# EAGLE design hp3547DisplayV2 (EAGLE 6.6.0)
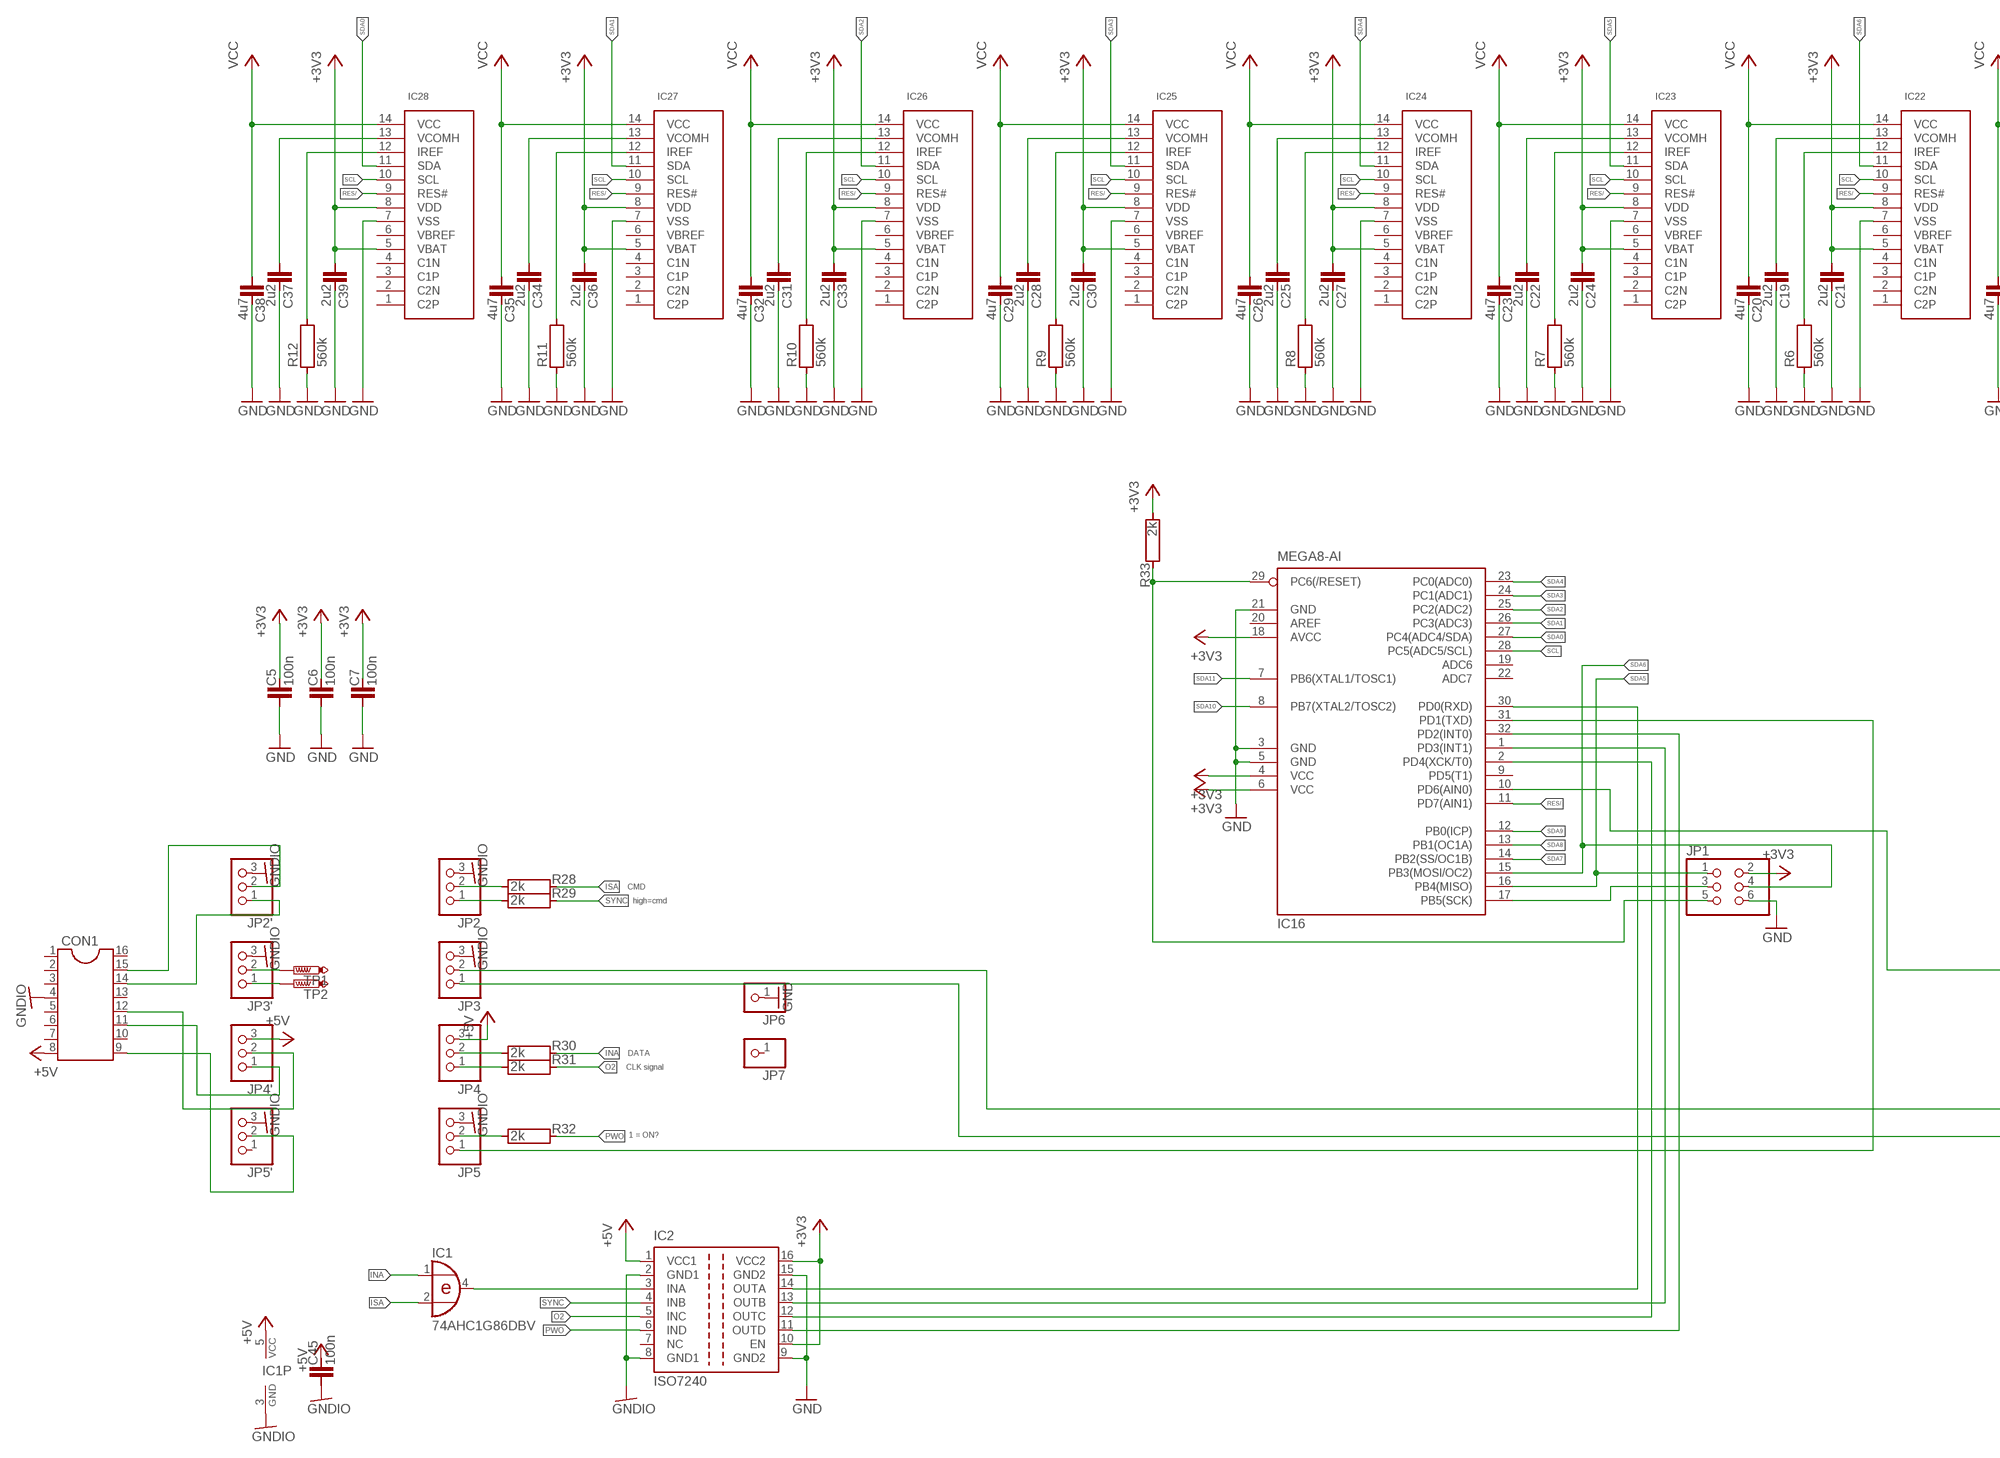
[diagram p0: schematic, sheet 1, part 1 of 2]
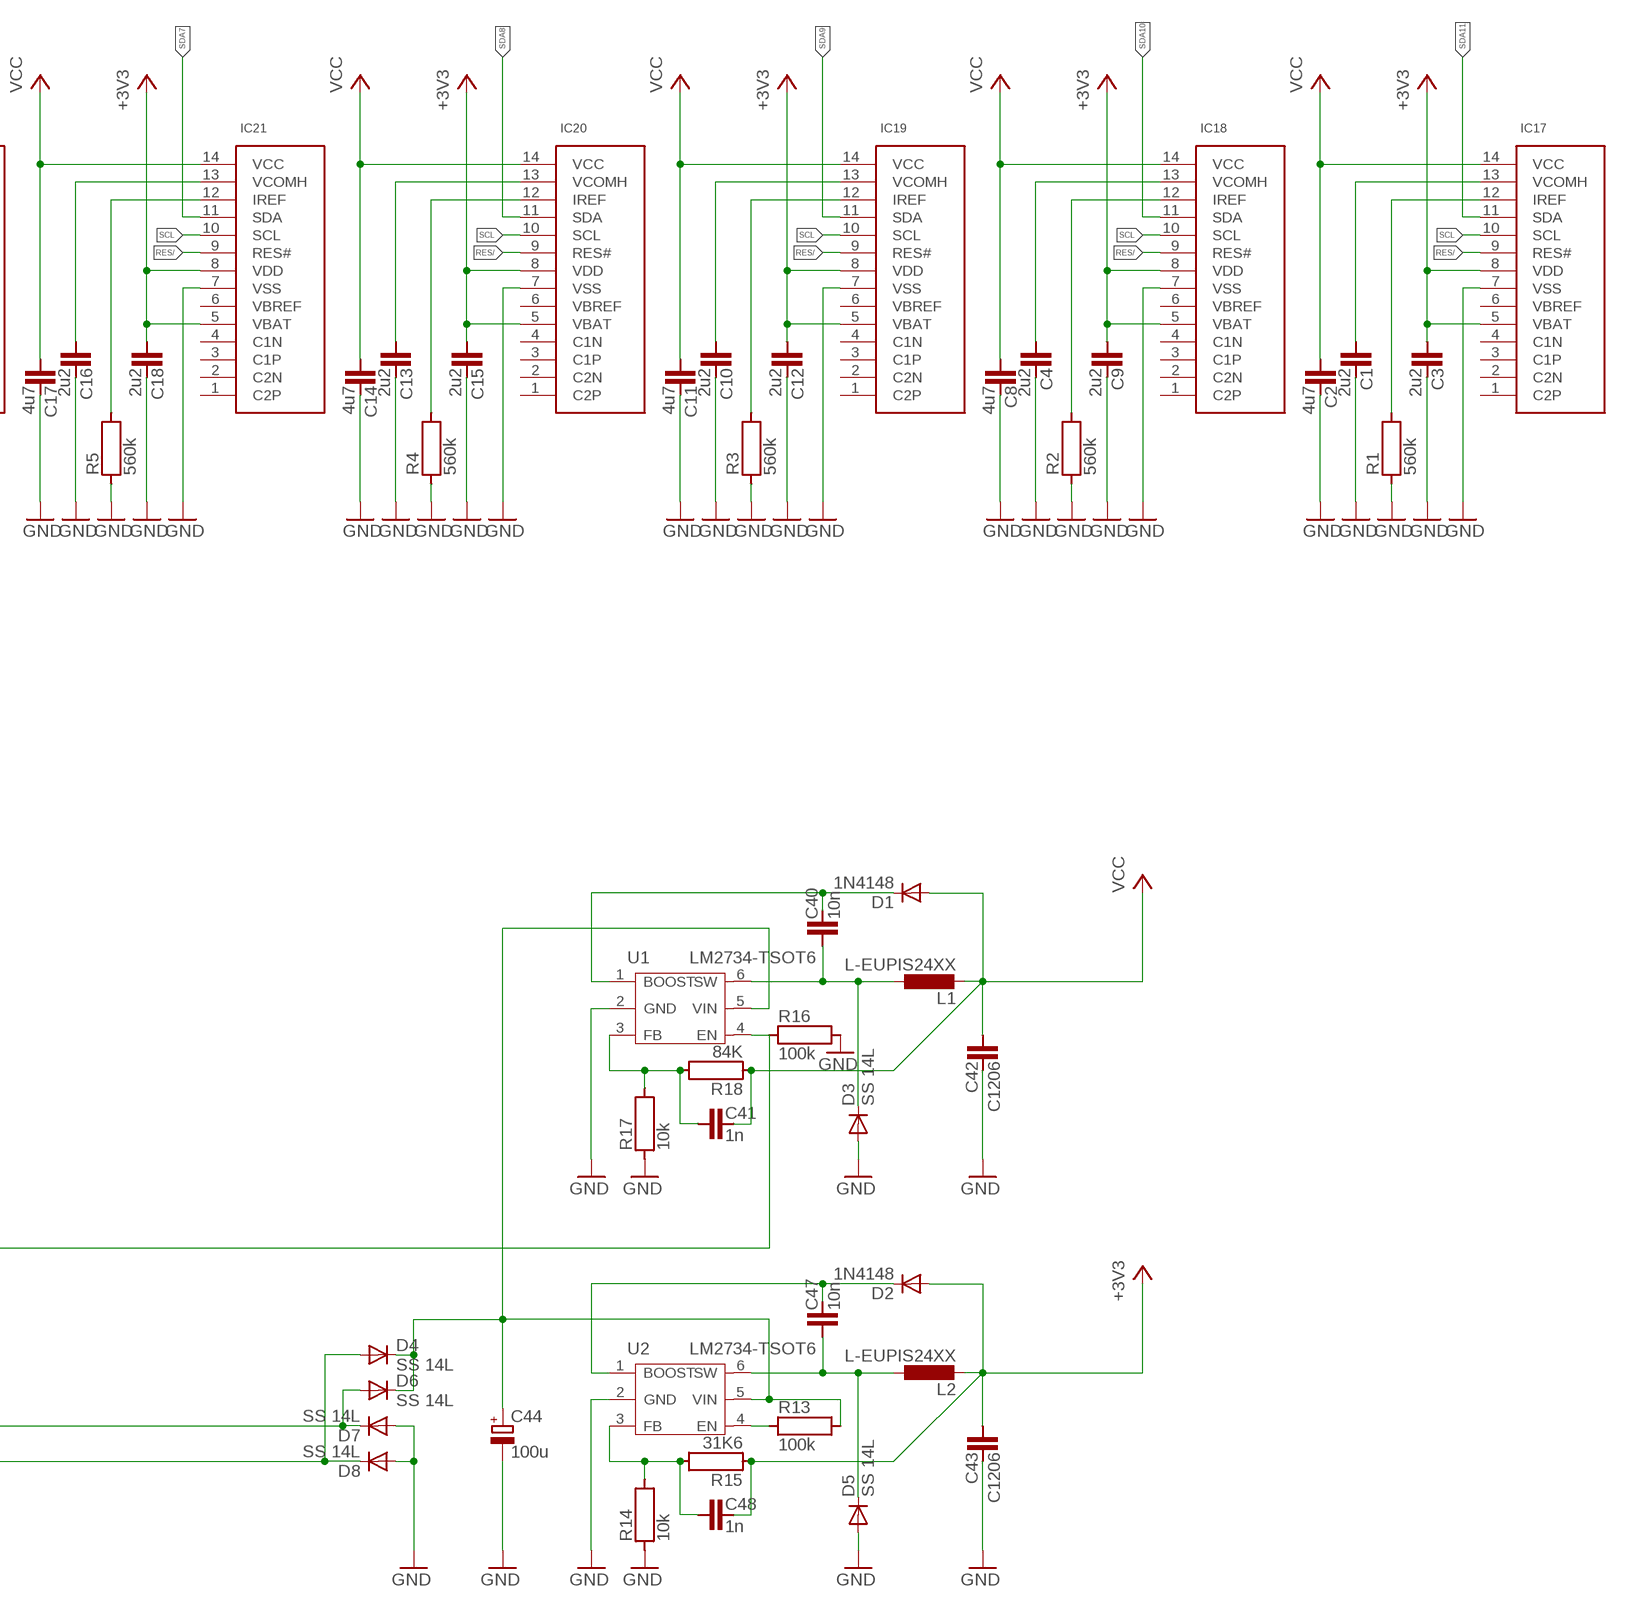
[diagram p1: schematic, sheet 1, part 2 of 2]

## Parts
C1  2u2  C0603  [C0603]
C2  4u7  C0805  [C0805]
C3  2u2  C0603  [C0603]
C4  2u2  C0603  [C0603]
C5  100n  C0603  [C0603]
C6  100n  C0603  [C0603]
C7  100n  C0603  [C0603]
C8  4u7  C0805  [C0805]
C9  2u2  C0603  [C0603]
C10  2u2  C0603  [C0603]
C11  4u7  C0805  [C0805]
C12  2u2  C0603  [C0603]
C13  2u2  C0603  [C0603]
C14  4u7  C0805  [C0805]
C15  2u2  C0603  [C0603]
C16  2u2  C0603  [C0603]
C17  4u7  C0805  [C0805]
C18  2u2  C0603  [C0603]
C19  2u2  C0603  [C0603]
C20  4u7  C0805  [C0805]
C21  2u2  C0603  [C0603]
C22  2u2  C0603  [C0603]
C23  4u7  C0805  [C0805]
C24  2u2  C0603  [C0603]
C25  2u2  C0603  [C0603]
C26  4u7  C0805  [C0805]
C27  2u2  C0603  [C0603]
C28  2u2  C0603  [C0603]
C29  4u7  C0805  [C0805]
C30  2u2  C0603  [C0603]
C31  2u2  C0603  [C0603]
C32  4u7  C0805  [C0805]
C33  2u2  C0603  [C0603]
C34  2u2  C0603  [C0603]
C35  4u7  C0805  [C0805]
C36  2u2  C0603  [C0603]
C37  2u2  C0603  [C0603]
C38  4u7  C0805  [C0805]
C39  2u2  C0603  [C0603]
C40  10n  C0603  [C0603]
C41  1n  C0603  [C0603]
C42  C1206  [C1206]
C43  C1206  [C1206]
C44  100u  CPOL-EUE  [PANASONIC_E]
C45  100n  C0603  [C0603]
C47  10n  C0603  [C0603]
C48  1n  C0603  [C0603]
CON1  DIL16BIGHOLE  [DIL16BIGHOLE]
D1  1N4148  DIODE-DO214AC  [DO214AC]
D2  1N4148  DIODE-DO214AC  [DO214AC]
D3  SS 14L  CGRM4001-G  [SOD-123_MINI-SMA]
D4  SS 14L  CGRM4001-G  [SOD-123_MINI-SMA]
D5  SS 14L  CGRM4001-G  [SOD-123_MINI-SMA]
D6  SS 14L  CGRM4001-G  [SOD-123_MINI-SMA]
D7  SS 14L  CGRM4001-G  [SOD-123_MINI-SMA]
D8  SS 14L  CGRM4001-G  [SOD-123_MINI-SMA]
IC1  74AHC1G86DBV  [SOT23-5]
IC2  ISO7240  [SO-16DW]
IC16  MEGA8-AI  [TQFP32-08]
IC17  OLED0.87  [OLED0.87]
IC18  OLED0.87  [OLED0.87]
IC19  OLED0.87  [OLED0.87]
IC20  OLED0.87  [OLED0.87]
IC21  OLED0.87  [OLED0.87]
IC22  OLED0.87  [OLED0.87]
IC23  OLED0.87  [OLED0.87]
IC24  OLED0.87  [OLED0.87]
IC25  OLED0.87  [OLED0.87]
IC26  OLED0.87  [OLED0.87]
IC27  OLED0.87  [OLED0.87]
IC28  OLED0.87  [OLED0.87]
JP1  PINHD-2X3  [2X03]
JP2  PINHD-1X3  [1X03]
JP2'  PINHD-1X3  [1X03]
JP3  PINHD-1X3  [1X03]
JP3'  PINHD-1X3  [1X03]
JP4  PINHD-1X3  [1X03]
JP4'  PINHD-1X3  [1X03]
JP5  PINHD-1X3  [1X03]
JP5'  PINHD-1X3  [1X03]
JP6  PINHD-1X1  [1X01]
JP7  PINHD-1X1  [1X01]
L1  L-EUPIS24XX  [PIS24XX]
L2  L-EUPIS24XX  [PIS24XX]
R1  560k  R0402  [R0402]
R2  560k  R0402  [R0402]
R3  560k  R0402  [R0402]
R4  560k  R0402  [R0402]
R5  560k  R0402  [R0402]
R6  560k  R0402  [R0402]
R7  560k  R0402  [R0402]
R8  560k  R0402  [R0402]
R9  560k  R0402  [R0402]
R10  560k  R0402  [R0402]
R11  560k  R0402  [R0402]
R12  560k  R0402  [R0402]
R13  100k  R0603  [R0603]
R14  10k  R0603  [R0603]
R15  31K6  R0603  [R0603]
R16  100k  R0603  [R0603]
R17  10k  R0603  [R0603]
R18  84K  R0603  [R0603]
R28  2k  R0603  [R0603]
R29  2k  R0603  [R0603]
R30  2k  R0603  [R0603]
R31  2k  R0603  [R0603]
R32  2k  R0603  [R0603]
R33  2k  R0603  [R0603]
TP1  PTR1PAD1-13Y  [P1-13Y]
TP2  PTR1PAD1-13Y  [P1-13Y]
U1  LM2734-TSOT6  [TSOT6]
U2  LM2734-TSOT6  [TSOT6]

## Nets
+3V3: C3.1 C5.2 C6.2 C7.2 C9.1 C12.1 C15.1 C18.1 C21.1 C24.1 C27.1 C30.1 C33.1 C36.1 C39.1 C43.1 C48.2 D2.A IC2.10(EN) IC2.16(VCC2) IC16.4(VCC) IC16.6(VCC) IC16.18(AVCC) IC17.5(VBAT) IC17.8(VDD) IC18.5(VBAT) IC18.8(VDD) IC19.5(VBAT) IC19.8(VDD) IC20.5(VBAT) IC20.8(VDD) IC21.5(VBAT) IC21.8(VDD) IC22.5(VBAT) IC22.8(VDD) IC23.5(VBAT) IC23.8(VDD) IC24.5(VBAT) IC24.8(VDD) IC25.5(VBAT) IC25.8(VDD) IC26.5(VBAT) IC26.8(VDD) IC27.5(VBAT) IC27.8(VDD) IC28.5(VBAT) IC28.8(VDD) JP1.2 L2.1 R15.1 R33.2
+5V: C45.2 CON1.8 IC1.5(VCC) IC2.1(VCC1) JP4'.3 JP4.3
GND: C1.2 C2.2 C3.2 C4.2 C5.1 C6.1 C7.1 C8.2 C9.2 C10.2 C11.2 C12.2 C13.2 C14.2 C15.2 C16.2 C17.2 C18.2 C19.2 C20.2 C21.2 C22.2 C23.2 C24.2 C25.2 C26.2 C27.2 C28.2 C29.2 C30.2 C31.2 C32.2 C33.2 C34.2 C35.2 C36.2 C37.2 C38.2 C39.2 C42.2 C43.2 C44.- D3.A D5.A D7.A D8.A IC2.9(GND2) IC2.15(GND2) IC16.3(GND) IC16.5(GND) IC16.21(GND) IC17.7(VSS) IC18.7(VSS) IC19.7(VSS) IC20.7(VSS) IC21.7(VSS) IC22.7(VSS) IC23.7(VSS) IC24.7(VSS) IC25.7(VSS) IC26.7(VSS) IC27.7(VSS) IC28.7(VSS) JP1.6 JP6.1 R1.1 R2.1 R3.1 R4.1 R5.1 R6.1 R7.1 R8.1 R9.1 R10.1 R11.1 R12.1 R14.1 R16.2 R17.1 U1.2(GND) U2.2(GND)
GNDIO: C45.1 CON1.4 IC1.3(GND) IC2.2(GND1) IC2.8(GND1) JP2'.3 JP2.3 JP3'.3 JP3.3 JP5'.3 JP5.3
INA: IC1.1(I0) R30.1
ISA: IC1.2(I1) R28.1
N$1: IC18.12(IREF) R2.2
N$2: C4.1 IC18.13(VCOMH)
N$3: IC17.12(IREF) R1.2
N$4: C1.1 IC17.13(VCOMH)
N$5: JP2.2 R28.2
N$6: IC19.12(IREF) R3.2
N$7: JP2.1 R29.2
N$8: C10.1 IC19.13(VCOMH)
N$9: JP4.2 R30.2
N$10: IC20.12(IREF) R4.2
N$11: C13.1 IC20.13(VCOMH)
N$12: JP4.1 R31.2
N$13: IC21.12(IREF) R5.2
N$14: C16.1 IC21.13(VCOMH)
N$15: JP5.2 R32.2
N$16: IC22.12(IREF) R6.2
N$17: C19.1 IC22.13(VCOMH)
N$18: C40.2 D1.C U1.1(BOOST)
N$19: IC23.12(IREF) R7.2
N$20: C22.1 IC23.13(VCOMH)
N$21: C40.1 D3.C L1.2 U1.6(SW)
N$22: IC24.12(IREF) R8.2
N$23: C25.1 IC24.13(VCOMH)
N$24: C47.2 D2.C U2.1(BOOST)
N$25: IC25.12(IREF) R9.2
N$26: C28.1 IC25.13(VCOMH)
N$27: C47.1 D5.C L2.2 U2.6(SW)
N$28: IC26.12(IREF) R10.2
N$29: C31.1 IC26.13(VCOMH)
N$30: C48.1 R14.2 R15.2 U2.3(FB)
N$31: IC27.12(IREF) R11.2
N$32: C34.1 IC27.13(VCOMH)
N$33: R13.1 U2.4(EN)
N$34: IC28.12(IREF) R12.2
N$35: C37.1 IC28.13(VCOMH)
N$36: IC16.31(PD1(TXD)) JP5.1
N$37: C41.1 R17.2 R18.2 U1.3(FB)
N$38: IC16.10(PD6(AIN0)) R16.1 U1.4(EN)
N$39: JP3'.1 TP2.TP
N$40: JP3'.2 TP1.TP
N$41: D6.A D7.C JP3.2
N$42: D4.A D8.C JP3.1
N$43: IC2.14(OUTA) IC16.30(PD0(RXD))
N$44: IC1.4(O) IC2.3(INA)
N$45: IC2.12(OUTC) IC16.2(PD4(XCK/T0))
N$46: IC2.13(OUTB) IC16.1(PD3(INT1))
N$47: IC2.11(OUTD) IC16.32(PD2(INT0))
N$48: IC16.29(PC6(/RESET)) JP1.5 R33.1
N$49: CON1.9 JP5'.2
N$51: IC16.17(PB5(SCK)) JP1.3
N$53: CON1.11 JP4'.1
N$54: CON1.12 JP4'.2
N$55: CON1.14 JP2'.1
N$56: CON1.15 JP2'.2
O2: IC2.5(INC) R31.1
PWO: IC2.6(IND) R32.1
RES/: IC16.11(PD7(AIN1)) IC17.9(RES#) IC18.9(RES#) IC19.9(RES#) IC20.9(RES#) IC21.9(RES#) IC22.9(RES#) IC23.9(RES#) IC24.9(RES#) IC25.9(RES#) IC26.9(RES#) IC27.9(RES#) IC28.9(RES#)
SCL: IC16.28(PC5(ADC5/SCL)) IC17.10(SCL) IC18.10(SCL) IC19.10(SCL) IC20.10(SCL) IC21.10(SCL) IC22.10(SCL) IC23.10(SCL) IC24.10(SCL) IC25.10(SCL) IC26.10(SCL) IC27.10(SCL) IC28.10(SCL)
SDA0: IC16.27(PC4(ADC4/SDA)) IC28.11(SDA)
SDA1: IC16.26(PC3(ADC3)) IC27.11(SDA)
SDA2: IC16.25(PC2(ADC2)) IC26.11(SDA)
SDA3: IC16.24(PC1(ADC1)) IC25.11(SDA)
SDA4: IC16.23(PC0(ADC0)) IC24.11(SDA)
SDA5: IC16.16(PB4(MISO)) IC23.11(SDA) JP1.1
SDA6: IC16.15(PB3(MOSI/OC2)) IC22.11(SDA) JP1.4
SDA7: IC16.14(PB2(SS/OC1B)) IC21.11(SDA)
SDA8: IC16.13(PB1(OC1A)) IC20.11(SDA)
SDA9: IC16.12(PB0(ICP)) IC19.11(SDA)
SDA10: IC16.8(PB7(XTAL2/TOSC2)) IC18.11(SDA)
SDA11: IC16.7(PB6(XTAL1/TOSC1)) IC17.11(SDA)
SYNC: IC2.4(INB) R29.1
VCC: C2.1 C8.1 C11.1 C14.1 C17.1 C20.1 C23.1 C26.1 C29.1 C32.1 C35.1 C38.1 C41.2 C42.1 D1.A IC17.14(VCC) IC18.14(VCC) IC19.14(VCC) IC20.14(VCC) IC21.14(VCC) IC22.14(VCC) IC23.14(VCC) IC24.14(VCC) IC25.14(VCC) IC26.14(VCC) IC27.14(VCC) IC28.14(VCC) L1.1 R18.1
VIN: C44.+ D4.C D6.C R13.2 U1.5(VIN) U2.5(VIN)
Unconnected: CON1.1 CON1.2 CON1.3 CON1.5 CON1.6 CON1.7 CON1.10 CON1.13 CON1.16 IC2.7(NC) IC16.9(PD5(T1)) IC16.19(ADC6) IC16.20(AREF) IC16.22(ADC7) IC17.1(C2P) IC17.2(C2N) IC17.3(C1P) IC17.4(C1N) IC17.6(VBREF) IC18.1(C2P) IC18.2(C2N) IC18.3(C1P) IC18.4(C1N) IC18.6(VBREF) IC19.1(C2P) IC19.2(C2N) IC19.3(C1P) IC19.4(C1N) IC19.6(VBREF) IC20.1(C2P) IC20.2(C2N) IC20.3(C1P) IC20.4(C1N) IC20.6(VBREF) IC21.1(C2P) IC21.2(C2N) IC21.3(C1P) IC21.4(C1N) IC21.6(VBREF) IC22.1(C2P) IC22.2(C2N) IC22.3(C1P) IC22.4(C1N) IC22.6(VBREF) IC23.1(C2P) IC23.2(C2N) IC23.3(C1P) IC23.4(C1N) IC23.6(VBREF) IC24.1(C2P) IC24.2(C2N) IC24.3(C1P) IC24.4(C1N) IC24.6(VBREF) IC25.1(C2P) IC25.2(C2N) IC25.3(C1P) IC25.4(C1N) IC25.6(VBREF) IC26.1(C2P) IC26.2(C2N) IC26.3(C1P) IC26.4(C1N) IC26.6(VBREF) IC27.1(C2P) IC27.2(C2N) IC27.3(C1P) IC27.4(C1N) IC27.6(VBREF) IC28.1(C2P) IC28.2(C2N) IC28.3(C1P) IC28.4(C1N) IC28.6(VBREF) JP5'.1 JP7.1

## Notes on the sheet
- CMD
- high=cmd
- DATA
- CLK signal
- 1 = ON?

## Library data of the parts
C1-C43 C45 C47 C48 = KaiLib:C
C44 = rcl:CPOL-EU: POLARIZED CAPACITOR, European symbol
CON1 = ic-package:DIL16: Dual In Line / Socket
D1 D2 = diode:DIODE-: DIODE
D3-D8 = diode:CGRM400*-G: Molded plasitc,JEDEC SOD-123/Mini SMA Source: Comchip CGRM4001-G.pdf
IC1 = 74xx-little-de:74*1G86: 2-input EXCLUSIV-OR gate
IC2 = texas:ISO7240: HIGH SPEED QUAD DIGITAL ISOLATORS Source: http://focus.ti.com/lit/ds/symlink/iso7240m.pdf; MPN: ISO7240MDW; OC_FARNELL: 1755124; OC_NEWARK: 58M0385
IC16 = atmel:MEGA8: MICROCONTROLLER 8 Kbytes FLASH, 1 kbytes SRAM, 512 bytes EEPROM, USART, 6-channel 10 bit ADC, 2-channel 8 bit ADC Pin compatible with Atmega48, ATMega88, ATMega168 Source: avr.lbr; MPN: ATMEGA8-16AU; OC_FARNELL: 9171371; OC_NEWARK: 73M8863
IC17-IC28 = KaiLib:OLED0.87
JP1 = pinhead:PINHD-2X3: PIN HEADER
JP2 JP2' JP3 JP3' JP4 JP4' JP5 JP5' = pinhead:PINHD-1X3: PIN HEADER
JP6 JP7 = pinhead:PINHD-1X1: PIN HEADER
L1 L2 = Inductor-Fastron:L-EU
R1-R18 R28-R33 = KaiLib:R
TP1 TP2 = testpad:PTR1: TEST PIN
U1 U2 = seeed:LM2734: Thin SOT23 1A Load Step-Down DC-DC Regulator http://www.national.com/ds/LM/LM2734.pdf

## Board
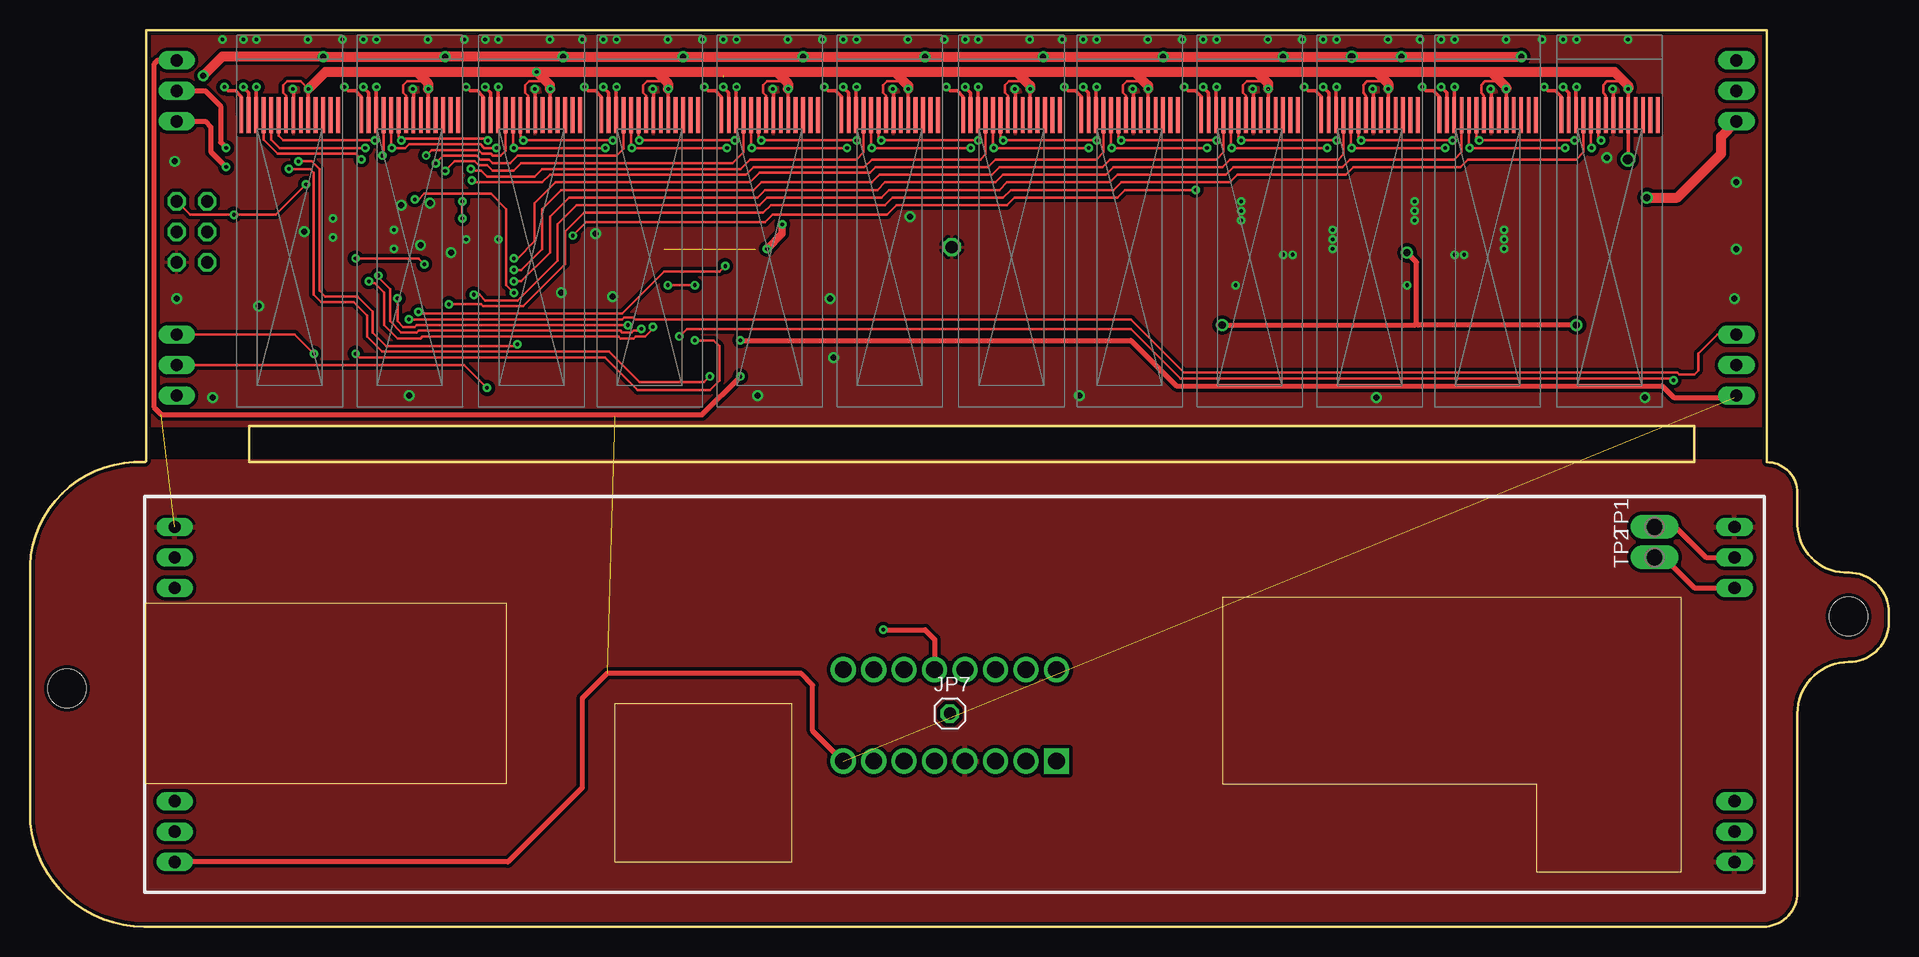
[diagram p2: board, top side]
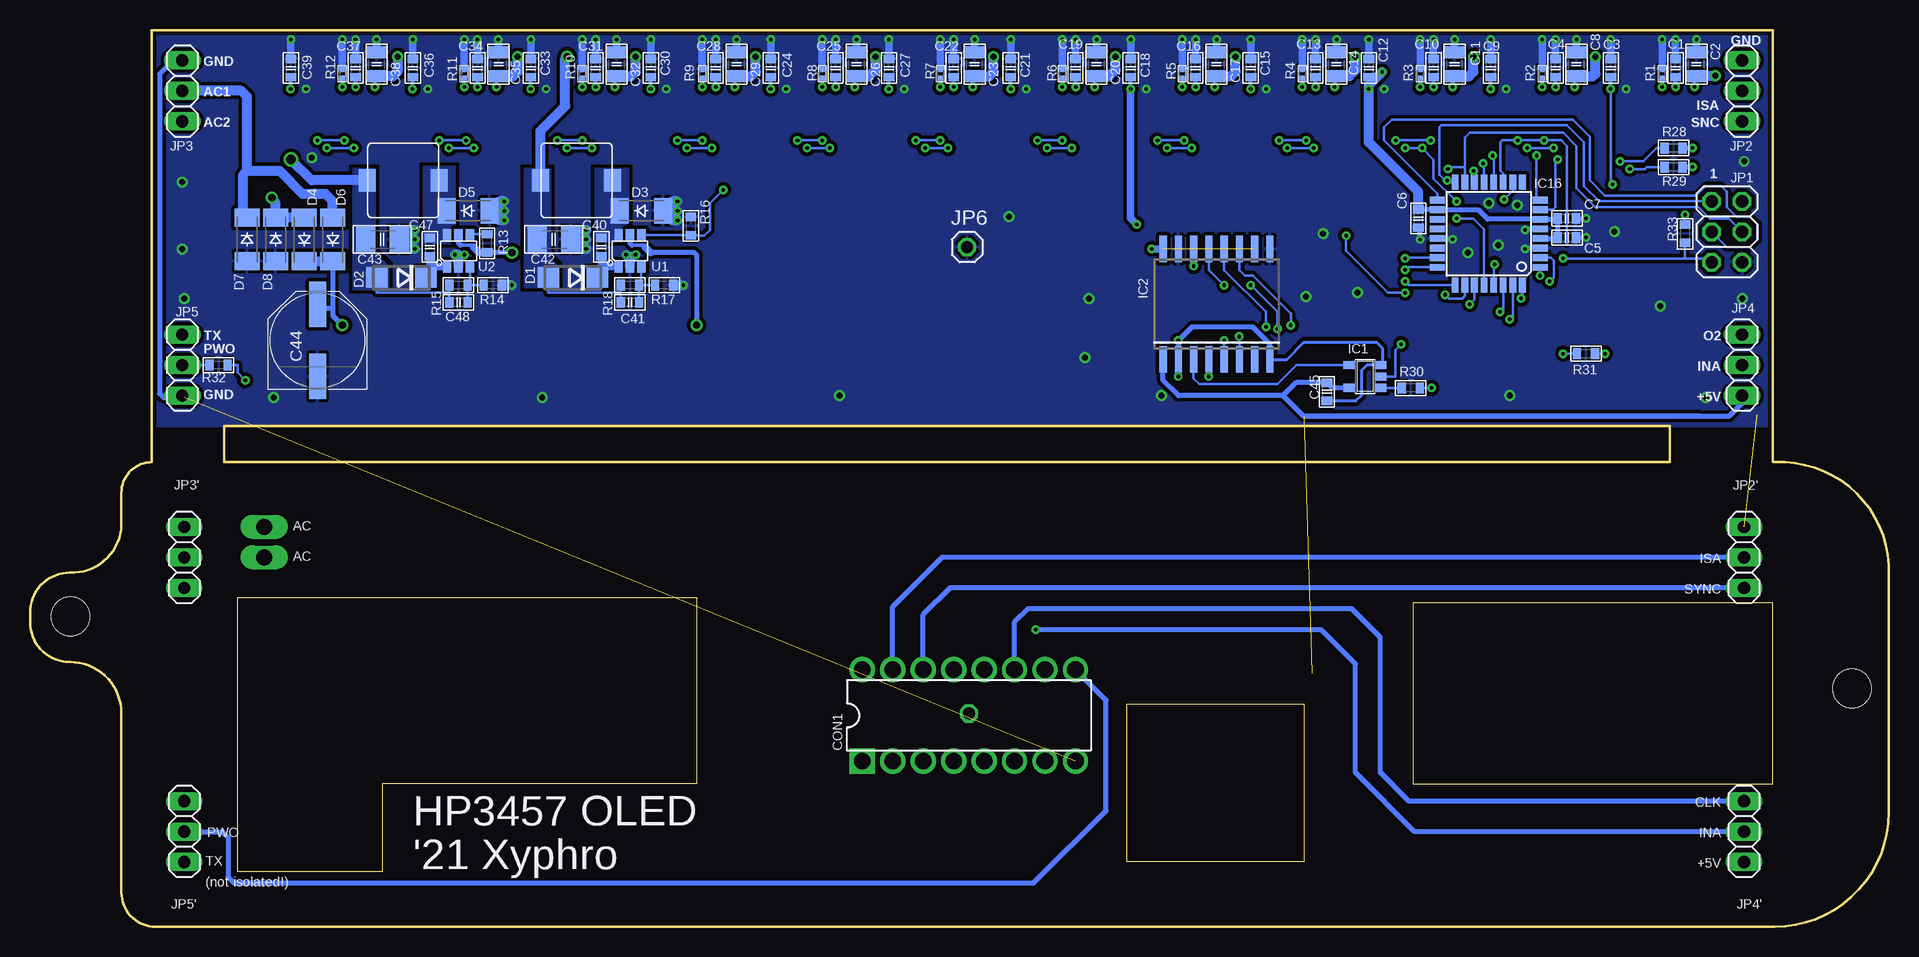
[diagram p3: board, bottom side, seen from below]

Size 154.94 x 74.77 mm. Coordinates in mm from the lower left corner, seen from the top.
Outline: 9.68,74.77 144.78,74.77 144.78,38.74 arc-90 147.32,36.2 147.32,33.5 arc90 151.61,29.53 arc-90 154.94,26.19 154.94,25.4 arc-90 151.61,22.07 arc90 147.32,17.78 147.32,2.86 arc-90 144.46,0 9.53,0 arc-90 0,9.53 0,30.16 arc-90 9.53,38.74 arc90 9.68,38.89 9.68,74.77
Copper layers (1*16): Top 0.035mm / dielectric 1.5mm / Bottom 0.035mm
Design rules "default *": minimum track width 5mil, minimum drill 0.29mm, track to track 5mil, track to pad 5mil, pad to pad 5mil, via to via 5mil, smd to smd 0mil, copper to edge 1mil, drill to drill 8mil, minimum pad ring 10mil, minimum via ring 8mil, stop-mask expansion 4mil, vias tented up to drill 0.55mm, thermal gap 10mil
Holes 3.2 mm at 3.07,19.88 151.57,25.88
Milling: 18 lines

### Footprints (pad centres in the part's own frame; a part is rotated, then mirrored left to right if it is on the bottom)
C0603 = smd 0.7 x 0.9: 1 -0.762,0; 2 0.762,0
C0805 = smd 1 x 1.7: 1 -1.016,0; 2 1.016,0
C1206 = smd 1.6 x 2.1: 1 -1.397,0; 2 1.397,0
PANASONIC_E = smd 3.8 x 1.4: + 3,0; - -3,0
DIL16BIGHOLE = drill 1.4 square: 1 -7.62,-3.81 | drill 1.4: 2 -5.08,-3.81; 3 -2.54,-3.81; 4 0,-3.81; 5 2.54,-3.81; 6 5.08,-3.81; 7 7.62,-3.81; 8 10.16,-3.81; 9 10.16,3.81; 10 7.62,3.81; 11 5.08,3.81; 12 2.54,3.81; 13 0,3.81; 14 -2.54,3.81; 15 -5.08,3.81; 16 -7.62,3.81
DO214AC = smd 1.8 x 1.7: A 2.05,0; C -2.05,0
SOD-123_MINI-SMA = smd 1.5 x 2.1: A 1.8,0; C -1.8,0
SOT23-5 = smd 0.69 x 0.99: 1 -0.95,-1.29; 2 0,-1.29; 3 0.95,-1.29; 4 0.95,1.3; 5 -0.95,1.3
SO-16DW = smd 0.6 x 2.2: 1 -4.445,-4.6; 2 -3.175,-4.6; 3 -1.905,-4.6; 4 -0.635,-4.6; 5 0.635,-4.6; 6 1.905,-4.6; 7 3.175,-4.6; 8 4.445,-4.6; 9 4.445,4.6; 10 3.175,4.6; 11 1.905,4.6; 12 0.635,4.6; 13 -0.635,4.6; 14 -1.905,4.6; 15 -3.175,4.6; 16 -4.445,4.6
TQFP32-08 = smd 1.27 x 0.559: 1 -4.293,2.8; 2 -4.293,2; 3 -4.293,1.2; 4 -4.293,0.4; 5 -4.293,-0.4; 6 -4.293,-1.2; 7 -4.293,-2; 8 -4.293,-2.8; 17 4.293,-2.8; 18 4.293,-2; 19 4.293,-1.2; 20 4.293,-0.4; 21 4.293,0.4; 22 4.293,1.2; 23 4.293,2; 24 4.293,2.8 | smd 0.559 x 1.27: 9 -2.8,-4.293; 10 -2,-4.293; 11 -1.2,-4.293; 12 -0.4,-4.293; 13 0.4,-4.293; 14 1.2,-4.293; 15 2,-4.293; 16 2.8,-4.293; 25 2.8,4.293; 26 2,4.293; 27 1.2,4.293; 28 0.4,4.293; 29 -0.4,4.293; 30 -1.2,4.293; 31 -2,4.293; 32 -2.8,4.293
OLED0.87 = smd 0.32 x 3: 1 3.93,11.95; 2 3.31,11.95; 3 2.69,11.95; 4 2.07,11.95; 5 1.45,11.95; 6 0.83,11.95; 7 0.21,11.95; 8 -0.41,11.95; 9 -1.03,11.95; 10 -1.65,11.95; 11 -2.27,11.95; 12 -2.89,11.95; 13 -3.51,11.95; 14 -4.13,11.95
2X03 = drill 1.016 octagon: 1 -2.54,-1.27; 2 -2.54,1.27; 3 0,-1.27; 4 0,1.27; 5 2.54,-1.27; 6 2.54,1.27
1X03 = drill 1.016 long: 1 -2.54,0; 2 0,0; 3 2.54,0
1X01 = drill 1.016 octagon: 1 0,0
PIS24XX = smd 1.4 x 1.9: 1 -3,0; 2 3,0
R0402 = smd 0.508 x 0.508: 1 -0.432,0; 2 0.432,0
R0603 = smd 0.7 x 0.9: 1 -0.762,0; 2 0.762,0
P1-13Y = drill 1.321 pad 1.905 long: TP 0,0
TSOT6 = smd 0.69 x 1: 1 -0.95,-1.3; 2 0,-1.3; 3 0.95,-1.3; 4 0.95,1.3; 5 0,1.3; 6 -0.95,1.3

### Placement (x,y rotation side)
C1  17.78,71.6 90 bottom
C2  16.03,71.91 90 bottom
C3  23.18,71.6 90 bottom
C4  27.78,71.6 90 bottom
C5  26.83,57.47 180 bottom
C6  39.21,59.05 90 bottom
C7  26.83,59.05 180 bottom
C8  26.04,71.91 90 bottom
C9  33.18,71.6 90 bottom
C10  37.94,71.6 90 bottom
C11  36.2,71.91 90 bottom
C12  43.34,71.6 90 bottom
C13  47.78,71.6 90 bottom
C14  46.04,71.91 90 bottom
C15  53.18,71.6 90 bottom
C16  57.78,71.6 90 bottom
C17  56.04,71.91 90 bottom
C18  63.18,71.6 90 bottom
C19  67.79,71.6 90 bottom
C20  66.04,71.91 90 bottom
C21  73.18,71.6 90 bottom
C22  77.95,71.6 90 bottom
C23  76.2,71.91 90 bottom
C24  93.19,71.6 90 bottom
C25  87.79,71.6 90 bottom
C26  86.04,71.91 90 bottom
C27  83.34,71.6 90 bottom
C28  97.79,71.6 90 bottom
C29  96.04,71.91 90 bottom
C30  103.19,71.6 90 bottom
C31  107.79,71.6 90 bottom
C32  106.05,71.91 90 bottom
C33  113.19,71.6 90 bottom
C34  117.63,71.6 90 bottom
C35  115.89,71.91 90 bottom
C36  123.03,71.6 90 bottom
C37  127.79,71.6 90 bottom
C38  126.05,71.91 90 bottom
C39  133.19,71.6 90 bottom
C40  107.31,56.67 270 bottom
C41  104.93,52.07 180 bottom
C42  111.28,57.31 0 bottom
C43  125.57,57.31 0 bottom
C44  130.97,48.89 90 bottom
C45  46.83,44.61 90 bottom
C47  121.6,56.67 270 bottom
C48  119.22,52.07 180 bottom
CON1  77.95,17.62 0 bottom
D1  109.7,54.13 180 bottom
D2  123.98,54.13 180 bottom
D3  103.98,59.69 0 bottom
D4  132.08,57.31 90 bottom
D5  118.43,59.69 0 bottom
D6  129.7,57.31 90 bottom
D7  136.84,57.31 270 bottom
D8  134.46,57.31 270 bottom
IC1  43.66,45.88 90 bottom
IC2  56.04,51.91 0 bottom
IC16  33.34,57.78 180 bottom
IC17  21.75,55.72 0 top
IC18  31.75,55.72 0 top
IC19  41.91,55.72 0 top
IC20  51.75,55.72 0 top
IC21  61.75,55.72 0 top
IC22  71.75,55.72 0 top
IC23  81.92,55.72 0 top
IC24  91.76,55.72 0 top
IC25  101.76,55.72 0 top
IC26  111.76,55.72 0 top
IC27  121.6,55.72 0 top
IC28  131.76,55.72 0 top
JP1  13.49,57.94 270 bottom
JP2  12.22,69.69 90 bottom
JP2'  12.06,30.8 90 bottom
JP3  142.24,69.69 90 bottom
JP3'  142.08,30.8 90 bottom
JP4  12.22,46.83 270 bottom
JP4'  12.06,7.94 270 bottom
JP5  142.24,46.83 270 bottom
JP5'  142.08,7.94 270 bottom
JP6  76.84,56.67 0 bottom
JP7  76.68,17.78 0 top
L1  109.38,62.23 0 bottom
L2  123.83,62.23 0 bottom
R1  18.89,71.12 270 bottom
R2  28.89,71.12 270 bottom
R3  39.05,71.12 270 bottom
R4  48.89,71.12 270 bottom
R5  58.9,71.12 270 bottom
R6  68.9,71.12 270 bottom
R7  79.06,71.12 270 bottom
R8  88.9,71.12 270 bottom
R9  98.9,71.12 270 bottom
R10  108.9,71.12 270 bottom
R11  118.75,71.12 270 bottom
R12  128.91,71.12 270 bottom
R13  116.84,56.99 270 bottom
R14  116.36,53.5 180 bottom
R15  119.22,53.5 0 bottom
R16  99.85,58.42 90 bottom
R17  102.08,53.5 180 bottom
R18  104.93,53.5 0 bottom
R28  17.94,64.93 0 bottom
R29  17.94,63.34 0 bottom
R30  39.85,44.93 0 bottom
R31  25.24,47.78 0 bottom
R32  139.22,46.83 180 bottom
R33  16.99,57.78 90 bottom
TP1  135.41,33.34 90 top
TP2  135.41,30.8 90 top
U1  104.93,56.36 0 bottom
U2  119.22,56.36 0 bottom

### Tracks (layer width: path | path; a pad name or v marks a point on that pad's centre or on a via)
+3V3  (via drill 0.3, 0.8)  (4 unrouted)
  Top 0.2: IC17.8 21.34,69.31 21.11,69.53 21.11,70.17 21.43,70.49 22.56,70.49 v23.2,69.85 | IC18.8 31.34,69.31 31.12,69.53 31.12,70.17 31.43,70.49 32.57,70.49 v33.2,69.85 | IC19.8 41.5,69.31 41.28,69.53 41.28,70.17 41.59,70.49 42.73,70.49 v43.36,69.85 | IC20.8 51.34,69.31 51.12,69.53 51.12,70.17 51.44,70.49 52.57,70.49 v53.2,69.85 | IC21.8 61.34,69.31 61.12,69.53 61.12,70.17 61.44,70.49 62.57,70.49 v63.2,69.85 | IC22.8 71.35,69.31 71.12,69.53 71.12,70.17 71.44,70.49 72.57,70.49 v73.21,69.85 | IC23.8 81.51,69.31 81.28,69.53 81.28,70.17 81.6,70.49 82.73,70.49 v83.37,69.85 | IC24.8 91.35,69.31 91.12,69.53 91.12,70.17 91.44,70.49 92.57,70.49 v93.21,69.85 | IC25.8 101.35,69.31 101.12,69.53 101.12,70.17 101.44,70.49 102.57,70.49 v103.21,69.85 | IC26.8 111.35,69.31 111.13,69.53 111.13,70.17 111.44,70.49 112.58,70.49 v113.21,69.85 | IC27.8 121.19,69.31 120.97,69.53 120.97,70.17 121.29,70.49 122.42,70.49 v123.05,69.85 | IC28.8 131.35,69.31 131.13,69.53 131.13,70.17 131.45,70.49 132.58,70.49 v133.21,69.85 | JP1.2 13.34,59.37 v16.99,59.37 20.48,59.37 v23.02,61.91
  Top 0.305: IC18.5 v33.2,69.85 | IC19.5 v43.36,69.85 | IC20.5 v53.2,69.85 | IC21.5 v63.2,69.85 | IC22.5 v73.21,69.85 | IC23.5 v83.37,69.85 | IC24.5 v93.21,69.85 | IC25.5 v103.21,69.85 | IC26.5 v113.21,69.85 | IC27.5 v123.05,69.85 | IC28.5 v133.21,69.85 133.21,64 | IC17.5 v23.2,69.85
  Top 0.61: v61.44,56.52 62.71,57.79 v62.71,58.58
  Top 0.813: v23.2,69.85 24.63,71.28 32.23,71.28 | 32.23,71.28 v42.23,71.28 | v42.23,71.28 52.23,71.28 | 52.23,71.28 62.23,71.28 | 62.23,71.28 72.07,71.28 | 72.07,71.28 82.23,71.28 | 82.23,71.28 92.08,71.28 | 92.08,71.28 102.24,71.28 | 102.24,71.28 112.24,71.28 | 112.24,71.28 121.76,71.28 | 121.76,71.28 132.08,71.28 133.21,70.15 v133.21,69.85 | 121.76,71.28 123.05,69.99 v123.05,69.85 | 112.24,71.28 113.21,70.31 v113.21,69.85 | 102.24,71.28 103.19,70.33 103.19,69.85 | 92.08,71.28 93.21,70.15 v93.21,69.85 | 82.23,71.28 83.37,70.15 v83.37,69.85 | 72.07,71.28 73.21,70.15 v73.21,69.85 | 62.23,71.28 63.18,70.33 63.18,69.85 | 52.23,71.28 53.18,70.33 53.18,69.85 | v43.36,69.85 43.34,69.87 43.34,70.17 v42.23,71.28 | 32.23,71.28 33.18,70.33 33.18,69.85 v33.2,69.85 | v133.19,63.98 133.21,64
  Bottom 0.2: R33.2 v16.99,59.37 | v23.02,61.91 23.18,62.07 23.18,69.83 v23.2,69.85 | D2.A 126.03,52.86 120.02,52.86 | 120.02,52.86 120.02,52.07 C48.2 | R15.1 119.98,52.86 120.02,52.86
  Bottom 0.305: v33.2,69.85 33.2,70.83 C9.1 | v43.36,69.85 43.36,70.83 C12.1 | v53.2,69.85 53.2,70.83 C15.1 | v63.2,69.85 63.2,70.83 C18.1 | v73.21,69.85 73.21,70.68 C21.1 | v83.37,69.85 83.37,70.83 C27.1 | v93.21,69.85 93.21,70.83 C24.1 | v103.21,69.85 103.21,70.83 C30.1 | v113.21,69.85 113.21,70.83 C33.1 | v123.05,69.85 123.05,70.83 C36.1 | v133.21,69.85 133.21,70.83 C39.1 | v23.2,69.85 23.2,70.83 C3.1
  Bottom 0.406: C6.2 39.21,59.79 IC16.18 34.23,59.79 33.43,58.99 IC16.6 | IC16.6 27.66,58.99 C7.2 | IC16.4 27.67,57.39 C5.2 27.62,57.5 27.62,59.06 27.69,58.99 IC16.6
  Bottom 0.61: IC2.16 v61.43,56.51 v61.44,56.52 | v62.71,58.58 63.2,59.08 v63.2,69.85
  Bottom 0.813: C6.2 39.21,61.28 43.34,65.41 43.34,70.17 v42.23,71.28 | L2.1 131.45,62.23 v133.19,63.98
  pour Bottom (isolate 0.305, rank 2, no thermals): 125.09,53.18 125.09,55.09 126.21,56.2 126.21,63.18 127.95,63.18 127.95,53.18
+5V  (2 unrouted)
  Top 0.2: 142.08,44.13 142.24,44.29
  Top 0.406: CON1.8 65.25,16.35 65.25,20.16 64.29,21.11 48.1,21.11 46.04,19.05 46.04,11.59 39.85,5.4 JP4'.3
  Bottom 0.2: 48.74,42.55 48.58,42.7 15.72,42.7 15.72,42.55
  Bottom 0.406: IC1.5 46.39,44.93 C45.2 49.4,45.37 50.48,44.29 | 50.48,44.29 59.21,44.29 60.48,45.56 IC2.1 | JP4.3 12.22,43.66 13.34,42.55 15.72,42.55 48.74,42.55 50.48,44.29
GND  (via drill 0.3, 0.5)
  Top 0.305: IC17.7 21.96,69.8 v21.91,69.85 | IC18.7 31.96,69.8 v31.91,69.85 | IC19.7 42.12,69.8 v42.07,69.85 | IC20.7 51.96,69.8 v51.91,69.85 | IC21.7 61.96,69.8 v61.91,69.85 | IC22.7 71.97,69.8 v71.91,69.85 | IC23.7 82.13,69.8 v82.07,69.85 | IC24.7 91.97,69.8 v91.92,69.85 | IC25.7 101.97,69.8 v101.92,69.85 | IC26.7 111.97,69.8 v111.92,69.85 | IC27.7 121.81,69.8 v121.76,69.85 | IC28.7 131.97,69.8 v131.92,69.85
  Bottom 0.406: IC16.21 36.43,57.39 v36.35,57.31 | IC16.5 30.24,58.19 v30.32,58.1 | IC16.3 30.25,56.59 v30.32,56.52 | C7.1 v25.24,59.06 | C5.1 v25.24,57.47 | C6.1 v39.05,57.31 | v118.75,56.04 v119.54,56.04 | v104.46,56.04 v105.25,56.04
  Bottom 0.61: v16.03,73.98 C2.2 | v17.78,73.98 C1.2 | v18.89,73.98 R1.1 | v23.18,73.98 C3.2 | v26.04,73.98 C8.2 | v27.78,73.98 C4.2 | v28.89,73.98 R2.1 | v33.18,73.98 C9.2 | v36.2,73.98 C11.2 | v37.94,73.98 C10.2 | v39.05,73.98 R3.1 | v43.34,73.98 C12.2 | v46.04,73.98 C14.2 | v47.78,73.98 C13.2 | v48.9,73.98 R4.1 | v53.18,73.98 C15.2 | v56.04,73.98 C17.2 | v57.79,73.98 C16.2 | v58.9,73.98 R5.1 | v63.18,73.98 C18.2 | v66.04,73.98 C20.2 | v67.79,73.98 C19.2 | v68.9,73.98 R6.1 | v73.18,73.98 C21.2 | v76.2,73.98 C23.2 | v77.95,73.98 C22.2 | R7.1 v79.06,73.98 | v83.34,73.98 C27.2 | v86.04,73.98 C26.2 | v87.79,73.98 C25.2 | v88.9,73.98 R8.1 | v93.19,73.98 C24.2 | v96.04,73.98 C29.2 | v97.79,73.98 C28.2 | v98.9,73.98 R9.1 | v103.19,73.98 C30.2 | v106.05,73.98 C32.2 | v107.79,73.98 C31.2 | v108.9,73.98 R10.1 | v113.19,73.98 C33.2 | v115.89,73.98 C35.2 | v117.63,73.98 C34.2 | v118.75,73.98 R11.1 | v123.03,73.98 C36.2 | v126.05,73.98 C38.2 | v127.79,73.98 C37.2 | v128.91,73.98 R12.1 | v133.19,73.98 C39.2
  Bottom 0.813: U2.2 119.22,56.04 v119.54,56.04 | v115.41,58.9 115.83,58.9 D5.A 116.26,60.06 | v115.41,60.48 115.83,60.48 116.26,60.06 | v115.41,59.69 115.89,59.69 116.26,60.06 | v114.78,53.5 R14.1 | R17.1 v100.49,53.5 | v100.97,58.9 101.39,58.9 D3.A | v100.97,60.48 101.39,60.48 D3.A | v100.97,59.69 D3.A | U1.2 104.93,55.72 v105.25,56.04 | v108.59,56.52 109.09,56.52 C42.2 109.47,57.72 | v108.59,58.1 109.09,58.1 109.47,57.72 | v108.59,57.31 109.06,57.31 109.47,57.72 | v122.87,56.52 123.38,56.52 C43.2 | v122.87,58.1 123.38,58.1 C43.2 | v122.87,57.31 C43.2
  other vias: 19.05,51.75 22.86,57.94 30.96,60.17 33.34,60.32 35.08,56.2 32.54,56.83 44.29,52.86 47.15,57.78 142.24,62.07 142.24,56.51 142.08,52.39 134.62,44.13 112.24,44.13 87.47,44.29 60.64,44.29 31.59,44.29 15.24,44.13 12.22,52.39 12.06,63.82 73.34,59.21 131.44,64.13 66.67,52.39 48.58,52.55 66.99,47.47
  pour Bottom (isolate 0.305, rank 3): 9.84,74.77 9.84,41.75 144.78,41.75 144.78,74.77
  pour Top (isolate 0.305): 9.68,74.77 9.68,41.75 144.78,41.75 144.78,74.77
GNDIO  (via drill 0.3)  (1 unrouted)
  Top 0.406: v59.21,48.9 91.76,48.9 95.57,45.09 136.05,45.09 137,44.13 142.08,44.13 JP5.3 | JP2.3 10.64,72.23 10.32,71.91 10.32,43.34 10.95,42.7 56.04,42.7 v59.21,45.88
  Bottom 0.254: C45.1 46.8,43.82 44.45,43.82 43.97,44.29 43.97,46.36 43.5,46.83 IC1.3 42.23,46.97 42.23,48.26 42.7,48.74 48.74,48.74 50.16,47.31 IC2.8
  Bottom 0.406: IC2.8 51.59,48.58 53.02,50.01 58.1,50.01 v59.21,48.9 IC2.2 v59.21,45.88 | JP3.3 143.03,72.23 144.15,71.12 144.15,44.45 143.83,44.13 142.4,44.13 JP5.3
  pour Top (isolate 0.305, rank 3): -0.16,38.73 -0.16,-0.16 155.1,-0.16 155.1,38.73
INA
  Bottom 0.2: R30.1 IC1.1
ISA  (via drill 0.3)
  Top 0.2: v22.38,63.82 23.5,63.82 24.13,63.18 24.13,53.02 24.61,52.55 27.31,52.55 28.58,51.28 28.58,49.53 29.69,48.42 40.48,48.42 v40.64,48.58
  Bottom 0.2: R28.1 19.37,64.93 20.48,63.82 v22.38,63.82 | v40.64,48.58 41.12,48.1 41.12,45.88 IC1.2
N$1  (via drill 0.3)
  Top 0.305: IC18.12 28.86,69.98 v28.89,70.01
  Bottom 0.305: v28.89,70.01 R2.2
N$2  (via drill 0.3)
  Top 0.305: IC18.13 28.24,69.55 v27.78,70.01
  Bottom 0.305: v27.78,70.01 C4.1 27.94,70.68 27.94,70.64
N$3  (via drill 0.3)
  Top 0.305: IC17.12 18.86,69.98 v18.89,70.01
  Bottom 0.305: v18.89,70.01 R1.2
N$4  (via drill 0.3)
  Top 0.305: IC17.13 18.24,69.55 v17.78,70.01
  Bottom 0.305: v17.78,70.01 C1.1
N$5  (via drill 0.3)
  Top 0.406: JP2.2 14.61,69.69 15.88,68.42 15.88,65.41 v16.35,64.93
  Bottom 0.406: v16.35,64.93 R28.2
N$6  (via drill 0.3)
  Top 0.305: IC19.12 39.02,69.98 v39.05,70.01
  Bottom 0.305: v39.05,70.01 R3.2
N$7  (via drill 0.3)
  Top 0.406: JP2.1 14.61,67.15 15.08,66.68 15.08,64.61 v16.35,63.34
  Bottom 0.406: v16.35,63.34 R29.2
N$8  (via drill 0.3)
  Top 0.305: IC19.13 38.4,69.55 v37.94,70.01
  Bottom 0.305: v37.94,70.01 C10.1
N$9  (via drill 0.3)
  Top 0.2: JP4.2 36.2,46.83 v38.1,44.93
  Bottom 0.2: v38.1,44.93 R30.2
N$10  (via drill 0.3)
  Top 0.305: IC20.12 48.86,69.98 v48.9,70.01
  Bottom 0.305: v48.9,70.01 R4.2
N$11  (via drill 0.3)
  Top 0.305: IC20.13 48.24,69.55 v47.78,70.01
  Bottom 0.305: v47.78,70.01 C13.1
N$12  (via drill 0.3)
  Top 0.2: JP4.1 22.07,49.37 v23.65,47.78
  Bottom 0.2: v23.65,47.78 R31.2
N$13  (via drill 0.3)
  Top 0.305: IC21.12 58.86,69.98 v58.9,70.01
  Bottom 0.305: v58.9,70.01 R5.2
N$14  (via drill 0.3)  (1 unrouted)
  Top 0.305: IC21.13 58.24,69.55 v57.79,70.01
  Bottom 0.305: v57.79,70.01 57.79,70.96
N$15
  Bottom 0.2: R32.2 JP5.2
N$16  (via drill 0.3)
  Top 0.305: IC22.12 68.87,69.98 v68.9,70.01
  Bottom 0.305: v68.9,70.01 R6.2
N$17  (via drill 0.3)
  Top 0.305: IC22.13 68.25,69.55 v67.79,70.01
  Bottom 0.305: v67.79,70.01 C19.1
N$18
  Bottom 0.61: U1.1 107.32,55.06 C40.2 107.32,54.47 arc90 D1.C
N$19  (via drill 0.3)
  Top 0.305: IC23.12 79.03,69.98 v79.06,70.01
  Bottom 0.305: v79.06,70.01 R7.2
N$20  (via drill 0.3)
  Top 0.305: IC23.13 78.41,69.55 v77.95,70.01
  Bottom 0.305: v77.95,70.01 C22.1
N$21
  pour Bottom (isolate 0.305, rank 2, no thermals): 105.57,57.15 107.79,57.15 107.79,63.18 105.09,63.18 105.09,58.74 105.57,58.26
N$22  (via drill 0.3)
  Top 0.305: IC24.12 88.87,69.98 v88.9,70.01
  Bottom 0.305: v88.9,70.01 R8.2
N$23  (via drill 0.3)
  Top 0.305: IC24.13 88.25,69.55 v87.79,70.01
  Bottom 0.305: v87.79,70.01 C25.1
N$24
  Bottom 0.61: U2.1 121.6,55.06 C47.2 121.6,54.13 D2.C
N$25  (via drill 0.3)
  Top 0.305: IC25.12 98.87,69.98 v98.9,70.01
  Bottom 0.305: v98.9,70.01 R9.2
N$26  (via drill 0.3)
  Top 0.305: IC25.13 98.25,69.55 v97.79,70.01
  Bottom 0.305: v97.79,70.01 C28.1
N$27
  pour Bottom (isolate 0.305, rank 2, no thermals): 119.86,56.99 122.08,56.99 122.08,63.34 119.54,63.34 119.54,58.58 119.86,58.26
N$28  (via drill 0.3)
  Top 0.305: IC26.12 108.87,69.98 v108.9,70.01
  Bottom 0.305: v108.9,70.01 R10.2
N$29  (via drill 0.3)
  Top 0.305: IC26.13 108.25,69.55 v107.79,70.01
  Bottom 0.305: v107.79,70.01 C31.1
N$30
  Bottom 0.2: U2.3 118.27,53.5 R15.2 | C48.1 R15.2 | R14.2 R15.2
N$31  (via drill 0.3)
  Top 0.305: IC27.12 118.71,69.98 v118.75,70.01
  Bottom 0.305: v118.75,70.01 R11.2
N$32  (via drill 0.3)
  Top 0.305: IC27.13 118.09,69.55 v117.63,70.01
  Bottom 0.305: v117.63,70.01 C34.1
N$33
  Bottom 0.2: U2.4 118.17,57.75 R13.1
N$34  (via drill 0.3)
  Top 0.305: IC28.12 128.87,69.98 v128.91,70.01
  Bottom 0.305: v128.91,70.01 R12.2
N$35  (via drill 0.3)
  Top 0.305: IC28.13 128.25,69.55 v127.79,70.01
  Bottom 0.305: v127.79,70.01 C37.1
N$36  (via drill 0.3)
  Top 0.2: v31.59,50.64 49.37,50.64 49.53,50.8 50.32,50.8 50.48,50.64 91.76,50.64 96.2,46.2 137.32,46.2 137.48,46.04 138.75,46.04 139.07,46.36 139.07,47.78 140.65,49.37 JP5.1
  Bottom 0.2: IC16.31 31.34,50.9 v31.59,50.64
N$37
  Bottom 0.2: C41.1 R18.2 103.98,53.5 | U1.3 103.98,53.5 | R17.2 103.98,53.5
N$38  (via drill 0.3)
  Top 0.2: v97.16,61.44 91.28,61.44 90.65,60.8 82.07,60.8 81.44,60.17 72.23,60.17 71.44,59.37 61.91,59.37 61.28,58.74 46.36,58.74 v45.24,57.63 | v32.07,60.64 32.39,60.64 32.86,61.12 38.42,61.12 39.69,59.85 39.69,53.5 v40.32,52.86
  Bottom 0.2: U1.4 102.65,57.66 R16.1 | 99.85,57.63 99.7,57.63 98.74,57.63 98.27,58.1 98.27,60.33 v97.16,61.44 | IC16.10 31.34,61.37 v32.07,60.64 | v40.32,52.86 41.75,52.86 45.24,56.36 v45.24,57.63
  Bottom 0.406: R16.1 99.73,57.66 99.7,57.63
N$39
  Top 0.406: TP2.TP 136.21,30.8 138.75,28.26 JP3'.1
N$40
  Top 0.406: TP1.TP 137.16,33.34 139.7,30.8 JP3'.2
N$41
  Bottom 0.813: D6.A 129.7,60.48 130.33,61.12 132.24,61.12 134.14,63.02 136.84,63.02 | D7.C 137.06,59.11 137.16,59.21 137.16,62.71 136.84,63.02 | 136.84,63.02 136.84,69.22 137.32,69.69 JP3.2
N$42  (via drill 0.6)
  Top 0.813: v134.78,60.8 137.32,60.8 140.97,64.45 140.97,65.88 JP3.1
  Bottom 0.813: D4.A D8.C 134.46,60.33 v134.78,60.8
N$43  (via drill 0.3)
  Top 0.2: v32.39,51.28 32.54,51.12 49.37,51.12 52.86,54.61 57.47,54.61 v57.94,55.09
  Bottom 0.2: IC16.30 32.14,51.52 v32.39,51.28 | v57.94,55.09 IC2.14
N$44
  Bottom 0.2: IC1.4 49.37,46.83 50.96,45.24 57.47,45.24 57.94,45.72 IC2.3
N$45  (via drill 0.3)
  Top 0.2: v28.26,53.82 28.42,53.66 28.73,53.66 29.53,52.86 29.53,50.17 30.64,49.05 32.54,49.05 32.7,49.21 49.05,49.21 49.21,49.05 50.32,49.05 50.48,49.21 51.28,49.21 51.91,49.85 v51.91,50.01
  Bottom 0.2: IC16.2 28.16,55.79 27.94,55.56 27.94,54.13 v28.26,53.82 | v51.91,50.01 51.91,51.28 55.4,54.77 IC2.12
N$46  (via drill 0.3)
  Top 0.2: v29.05,54.29 29.05,54.13 30,53.18 30,50.48 30.96,49.53 32.23,49.53 32.39,49.69 49.21,49.69 49.37,49.53 50.17,49.53 50.32,49.69 50.8,49.69 v50.96,49.85 | v53.18,53.5 v55.4,53.5
  Bottom 0.2: IC16.1 v29.05,54.3 v29.05,54.29 | v50.96,49.85 50.96,51.28 v53.18,53.5 | v55.4,53.5 56.67,54.77 IC2.13
N$47  (via drill 0.3)
  Top 0.2: v30.64,52.39 30.64,50.48 31.12,50.01 32.07,50.01 32.23,50.17 v49.85,50.17
  Bottom 0.2: IC16.32 30.54,52.49 v30.64,52.39 | v49.85,50.17 49.85,51.12 53.02,54.29 53.66,54.29 54.13,54.77 IC2.11
N$48  (via drill 0.3)
  Top 0.2: v32.86,55.25 32.39,55.72 v27.15,55.72
  Bottom 0.2: IC16.29 32.94,55.17 v32.86,55.25 | v27.15,55.72 16.99,55.72 | JP1.5 15.08,55.72 16.99,55.72 | 16.99,55.72 R33.1
N$49
  Bottom 0.406: JP5'.2 138.91,7.94 138.43,7.46 138.43,4.13 137.95,3.65 71.28,3.65 65.25,9.68 65.25,18.89 CON1.9
N$51
  Bottom 0.2: IC16.17 37.63,61.13 42.07,65.56 42.07,66.68 41.43,67.31 26.35,67.31 24.92,65.88 24.92,62.23 23.65,60.96 16.03,60.96 15.24,61.75 13.97,61.75 13.49,61.28 13.49,60.01 12.7,59.21 11.59,59.21 10.95,58.58 10.95,57.31 11.59,56.67 13.49,56.67 JP1.3
N$53
  Bottom 0.406: JP4'.1 40.01,10.48 42.39,12.86 42.39,24.13 44.77,26.51 71.76,26.51 72.87,25.4 CON1.11
N$54  (via drill 0.3)
  Top 0.406: v71.12,24.77 74.61,24.77 75.41,23.97 CON1.12
  Bottom 0.406: JP4'.2 39.53,7.94 44.45,12.86 44.45,21.91 47.31,24.77 v71.12,24.77
N$55
  Bottom 0.406: JP2'.1 78.26,28.26 80.49,26.04 CON1.14
N$56
  Bottom 0.406: JP2'.2 78.9,30.8 83.03,26.67 CON1.15
O2  (via drill 0.3)
  Top 0.2: v27.15,47.78 27.46,47.47 47.94,47.47 50.64,44.77 56.67,44.77 57.47,45.56 57.47,48.42 56.99,48.9 v55.4,48.9
  Bottom 0.2: R31.1 v27.15,47.78 | v55.4,48.9 IC2.5
PWO  (via drill 0.3)
  Top 0.2: v54.13,49.21 54.77,49.85 91.76,49.85 95.89,45.72 136.84,45.72 v137,45.56
  Bottom 0.2: R32.1 137.64,46.83 137.64,46.2 v137,45.56 | IC2.6 v54.13,49.21
RES/  (via drill 0.3)
  Top 0.2: IC17.9 20.72,65.96 21.11,65.56 v28.73,65.56 | IC18.9 30.72,65.8 v30.96,65.56 31.12,65.72 37.94,65.72 v38.18,65.56 | IC19.9 40.88,65.65 v41.12,65.56 v48.58,65.56 | IC20.9 50.72,65.64 v50.8,65.56 v58.74,65.56 | IC21.9 60.72,65.8 v60.96,65.56 v68.9,65.56 | IC22.9 70.73,65.8 v70.96,65.56 v79.06,65.56 | IC23.9 80.89,65.8 v81.12,65.56 v88.9,65.56 | IC24.9 90.73,65.8 v90.96,65.56 v98.9,65.56 | IC25.9 100.73,65.8 v100.97,65.56 v108.9,65.56 | IC26.9 110.73,65.8 v110.97,65.56 v118.59,65.56 | IC27.9 120.57,65.8 v120.81,65.56 v128.75,65.56 | IC28.9 130.73,65.8 v130.97,65.56
  Bottom 0.2: v38.18,65.56 v41.12,65.56 | v48.58,65.56 v50.8,65.56 | v58.74,65.56 v60.96,65.56 | v68.9,65.56 v70.96,65.56 | v79.06,65.56 v81.12,65.56 | v88.9,65.56 v90.96,65.56 | v98.9,65.56 v100.97,65.56 | v108.9,65.56 v110.97,65.56 | v118.59,65.56 v120.81,65.56 | v128.75,65.56 v130.97,65.56 | 26.83,56.99 26.83,65.09 27.31,65.56 v28.73,65.56 v30.96,65.56 32.23,65.56 32.39,65.41 32.39,63.02 32.14,62.78 IC16.11
SCL  (via drill 0.3)
  Top 0.2: IC17.10 20.1,65.63 20.8,64.93 v27.94,64.93 | IC18.10 30.1,64.99 v30.16,64.93 31.27,64.93 31.59,65.25 37.54,65.25 37.86,64.93 v38.89,64.93 | v40.32,64.93 40.26,65.03 IC19.10 40.26,64.99 v40.32,64.93 | v40.32,64.93 v47.94,64.93 | IC20.10 50.1,64.99 v50.17,64.93 v58.1,64.93 | IC21.10 60.1,64.99 v60.17,64.93 v68.1,64.93 | IC22.10 70.11,64.99 v70.17,64.93 v78.42,64.93 | IC23.10 80.27,64.99 v80.33,64.93 v88.27,64.93 | IC24.10 90.11,64.99 v90.17,64.93 v98.11,64.93 | IC25.10 100.11,64.99 v100.17,64.93 v108.11,64.93 | IC26.10 110.11,64.99 v110.17,64.93 v117.95,64.93 | IC27.10 119.95,64.99 v120.02,64.93 v127.95,64.93 | IC28.10 130.11,64.99 v130.18,64.93 | v36.04,59.06 v36.04,60.48
  Bottom 0.2: v27.94,64.93 v30.16,64.93 | v40.32,64.93 v38.89,64.93 37.94,63.98 37.94,62.39 v36.04,60.48 | v47.94,64.93 v50.17,64.93 | v58.1,64.93 v60.17,64.93 | v68.1,64.93 v70.17,64.93 | v78.42,64.93 v80.33,64.93 | v88.27,64.93 v90.17,64.93 | v98.11,64.93 v100.17,64.93 | v108.11,64.93 v110.17,64.93 | v117.95,64.93 v120.02,64.93 | v127.95,64.93 v130.18,64.93 | IC16.28 33.74,58.19 34.61,59.06 v36.04,59.06
SDA0  (via drill 0.3)
  Top 0.2: v34.93,51.91 37.62,51.91 37.78,51.75 41.12,51.75 44.61,55.25 44.61,57.94 46.2,59.53 61.12,59.53 61.75,60.17 71.28,60.17 71.91,60.8 81.12,60.8 81.76,61.44 90.33,61.44 90.96,62.07 100.01,62.07 100.65,62.71 109.7,62.71 110.33,63.34 119.22,63.34 119.86,63.98 128.91,63.98 129.49,64.56 IC28.11
  Bottom 0.2: IC16.27 34.54,52.3 v34.93,51.91
SDA1  (via drill 0.3)
  Top 0.2: v36.99,52.71 37.47,52.71 37.94,52.23 40.64,52.23 43.97,55.56 43.97,58.58 45.56,60.17 60.8,60.17 61.44,60.8 70.96,60.8 71.6,61.44 80.8,61.44 81.44,62.07 90.01,62.07 90.65,62.71 99.7,62.71 100.33,63.34 109.38,63.34 110.01,63.98 118.75,63.98 119.33,64.56 IC27.11
  Bottom 0.2: IC16.26 35.34,52.61 35.56,52.39 36.67,52.39 v36.99,52.71
SDA2  (via drill 0.3)
  Top 0.2: v40.32,53.82 40.96,53.82 43.34,56.2 43.34,59.21 44.93,60.8 60.64,60.8 61.28,61.44 70.64,61.44 71.28,62.07 80.49,62.07 81.12,62.71 89.69,62.71 90.33,63.34 99.38,63.34 100.01,63.98 109.06,63.98 109.49,64.41 IC26.11
  Bottom 0.2: IC16.25 40,53.49 v40.32,53.82
SDA3  (via drill 0.3)
  Top 0.2: v40.32,54.77 40.96,54.77 42.7,56.52 42.7,59.85 44.29,61.44 60.33,61.44 60.96,62.07 70.17,62.07 70.8,62.71 80.17,62.71 80.8,63.34 89.38,63.34 90.01,63.98 98.9,63.98 99.49,64.56 IC25.11
  Bottom 0.2: IC16.24 40.27,54.99 v40.32,54.77
SDA4  (via drill 0.3)
  Top 0.2: v40.32,55.72 40.64,55.72 42.07,57.15 42.07,60.33 43.82,62.07 60.01,62.07 60.8,62.87 70.01,62.87 70.49,63.34 79.85,63.34 80.49,63.98 88.9,63.98 89.49,64.56 IC24.11
  Bottom 0.2: IC16.23 40.26,55.79 v40.32,55.72
SDA5  (via drill 0.3)
  Top 0.2: IC23.11 79.65,64.41 79.22,63.98 70.17,63.98 69.53,63.34 60.33,63.34 59.69,62.71 43.34,62.71 42.7,62.07 36.99,62.07 v36.83,62.23
  Bottom 0.2: JP1.1 24.13,60.48 25.4,61.75 25.4,65.41 26.83,66.83 37.31,66.83 37.47,66.68 37.47,62.71 36.99,62.23 v36.83,62.23 36.82,62.08 IC16.16
SDA6  (via drill 0.3)
  Top 0.2: IC22.11 69.49,64.56 68.9,63.98 60.01,63.98 59.21,63.18 42.7,63.18 42.07,62.55 38.1,62.55 37.62,63.02 36.91,63.02 v36.75,63.18
  Bottom 0.2: JP1.4 13.34,59.06 14.92,59.06 15.88,60.01 24.45,60.01 26.04,61.6 26.04,65.09 27.15,66.2 34.93,66.2 35.34,65.79 IC16.15 35.34,63.28 35.4,63.34 36.51,63.34 v36.75,63.18
SDA7  (via drill 0.3)
  Top 0.2: v34.61,63.02 35.4,63.82 37.07,63.82 37.39,63.5 38.1,63.5 38.58,63.02 40.32,63.02 40.96,63.66 58.58,63.66 59.48,64.56 IC21.11
  Bottom 0.2: IC16.14 34.54,62.95 v34.61,63.02
SDA8  (via drill 0.3)
  Top 0.2: v33.81,63.66 34.45,64.29 37.23,64.29 37.54,63.98 38.26,63.98 38.58,63.66 40.01,63.66 40.64,64.29 48.9,64.29 49.48,64.88 IC20.11
  Bottom 0.2: IC16.13 33.74,63.58 v33.81,63.66
SDA9  (via drill 0.3)
  Top 0.2: v33.02,64.29 33.5,64.77 37.39,64.77 37.7,64.45 38.42,64.45 38.58,64.29 39.21,64.29 39.64,64.72 IC19.11
  Bottom 0.2: IC16.12 32.94,64.21 v33.02,64.29
SDA10  (via drill 0.3)
  Top 0.2: IC18.11 29.48,64.41 v29.37,64.29
  Bottom 0.2: v29.37,64.29 29.37,60.64 29.1,60.64 IC16.8
SDA11  (via drill 0.3)
  Top 0.2: IC17.11 19.48,65.61 20.64,64.45 27.15,64.45 v27.62,63.98
  Bottom 0.2: v27.62,63.98 27.78,63.82 27.78,60.01 28,59.79 IC16.7
SYNC  (via drill 0.3)
  Top 0.2: v21.59,63.18 23.34,63.18 23.65,62.87 23.65,52.71 24.29,52.07 26.99,52.07 28.1,50.96 28.1,49.21 29.37,47.94 48.26,47.94 50.8,45.4 56.2,45.4 v56.67,45.88
  Bottom 0.2: R29.1 20.16,63.34 20.32,63.18 v21.59,63.18 | v56.67,45.88 IC2.4
VCC  (via drill 0.3, 0.5, 0.6)
  Top 0.305: IC18.14 27.62,69.22 27.15,69.69 26.51,69.69 v26.19,70.01 | IC19.14 37.78,69.22 37.31,69.69 36.67,69.69 v36.35,70.01 | IC20.14 47.62,69.22 47.15,69.69 46.51,69.69 v46.2,70.01 | IC21.14 57.62,69.22 57.15,69.69 56.52,69.69 v56.2,70.01 | IC22.14 67.63,69.22 67.15,69.69 66.52,69.69 v66.2,70.01 | IC23.14 77.79,69.22 77.31,69.69 76.68,69.69 v76.36,70.01 | IC24.14 87.63,69.22 87.15,69.69 86.52,69.69 v86.2,70.01 | IC25.14 97.63,69.22 97.16,69.69 96.52,69.69 v96.2,70.01 | IC26.14 107.63,69.22 107.16,69.69 106.52,69.69 v106.2,70.01 | IC27.14 117.47,69.22 117,69.69 116.36,69.69 v116.05,70.01 | IC28.14 127.63,69.22 127.16,69.69 126.52,69.69 v126.21,70.01 | IC17.14 17.62,69.22 17.15,69.69 16.51,69.69 v16.19,70.01
  Top 0.813: v124.3,72.55 v114.3,72.55 v110.17,72.55 v104.46,72.55 v94.46,72.55 v84.46,72.55 v74.61,72.55 v64.45,72.55 v54.45,72.55 v44.45,72.55 v34.61,72.55 v24.45,72.55 16.03,72.55 v14.45,70.96
  Bottom 0.2: D1.A 111.75,52.86 105.73,52.86 | 105.73,52.86 105.73,53.5 R18.1 | C41.2 105.7,52.86 105.73,52.86
  Bottom 0.305: v26.19,70.01 26.19,70.74 C8.1 | v36.35,70.01 36.35,70.74 C11.1 | v46.2,70.01 46.2,70.74 C14.1 | v56.2,70.01 56.2,70.74 C17.1 | v66.2,70.01 66.2,70.74 C20.1 | v76.36,70.01 76.36,70.33 76.52,70.49 76.52,70.58 C23.1 | v86.2,70.01 86.2,70.74 C26.1 | v96.2,70.01 96.2,70.74 C29.1 | v106.2,70.01 106.2,70.74 C32.1 | v116.05,70.01 116.05,70.74 C35.1 | v126.21,70.01 126.21,70.74 C38.1 | v16.19,70.01 16.19,70.74 C2.1
  Bottom 0.813: v124.3,72.55 124.3,71.28 124.68,70.9 C38.1 | C35.1 114.68,70.9 114.3,71.28 v114.3,72.55 | C32.1 104.84,70.9 104.46,71.28 v104.46,72.55 | C29.1 94.84,70.9 94.46,71.28 v94.46,72.55 | C26.1 84.99,70.9 84.46,71.44 v84.46,72.55 | C23.1 74.99,70.9 74.61,71.28 v74.61,72.55 | C20.1 64.99,70.9 64.45,71.44 v64.45,72.55 | C17.1 54.83,70.9 54.45,71.28 v54.45,72.55 | C14.1 44.99,70.9 44.45,71.44 v44.45,72.55 | C11.1 34.99,70.9 34.61,71.28 v34.61,72.55 | C8.1 24.67,70.9 24.45,71.12 v24.45,72.55 | v14.45,70.96 14.51,70.9 C2.1 | L1.1 112.38,66.37 110.33,68.42 110.33,72.39 v110.17,72.55
  pour Bottom (isolate 0.305, rank 2, no thermals): 110.97,53.34 113.67,53.34 113.67,63.18 111.6,63.18 111.6,55.72 110.97,55.09
VIN  (via drill 0.6)
  Top 0.406: v99.38,50.17 115.41,50.17 115.57,50.32 | 115.57,50.32 115.57,55.4 v114.78,56.2 | v128.91,50.17 115.73,50.17 115.57,50.32
  Bottom 0.305: 119.06,56.83 118.11,56.83 117.95,56.67 | 104.78,56.83 103.82,56.83 103.66,56.67
  Bottom 0.406: U2.5 119.22,56.99 119.06,56.83 | U1.5 104.93,56.99 104.78,56.83 | v99.38,50.17 99.38,56.04 99.57,56.23 103.22,56.23 | v114.78,56.2 116.81,56.2 R13.2 | D6.C 129.7,51.59 | 129.7,51.59 129.7,50.96 v128.91,50.17 | C44.+ 130.97,51.59 129.7,51.59
  Bottom 0.61: 117.95,56.67 117.51,56.23 R13.2 | 103.66,56.67 103.22,56.23
  Bottom 0.813: D4.C D6.C

### Text on the board
bPlace: GND | GND | ISA | AC1 | SNC | AC2 | 1 | O2 | TX | PWO | INA | +5V | GND | AC | ISA | AC | SYNC | CLK | HP3457 OLED | INA | PWO | +5V | '21 Xyphro | TX | (not isolated!)